# EAGLE schematic TigardBR (EAGLE 9.6.2)
H1: Controlando Elétrons; H2: Tiago Silva; PROJECT: TigardBR
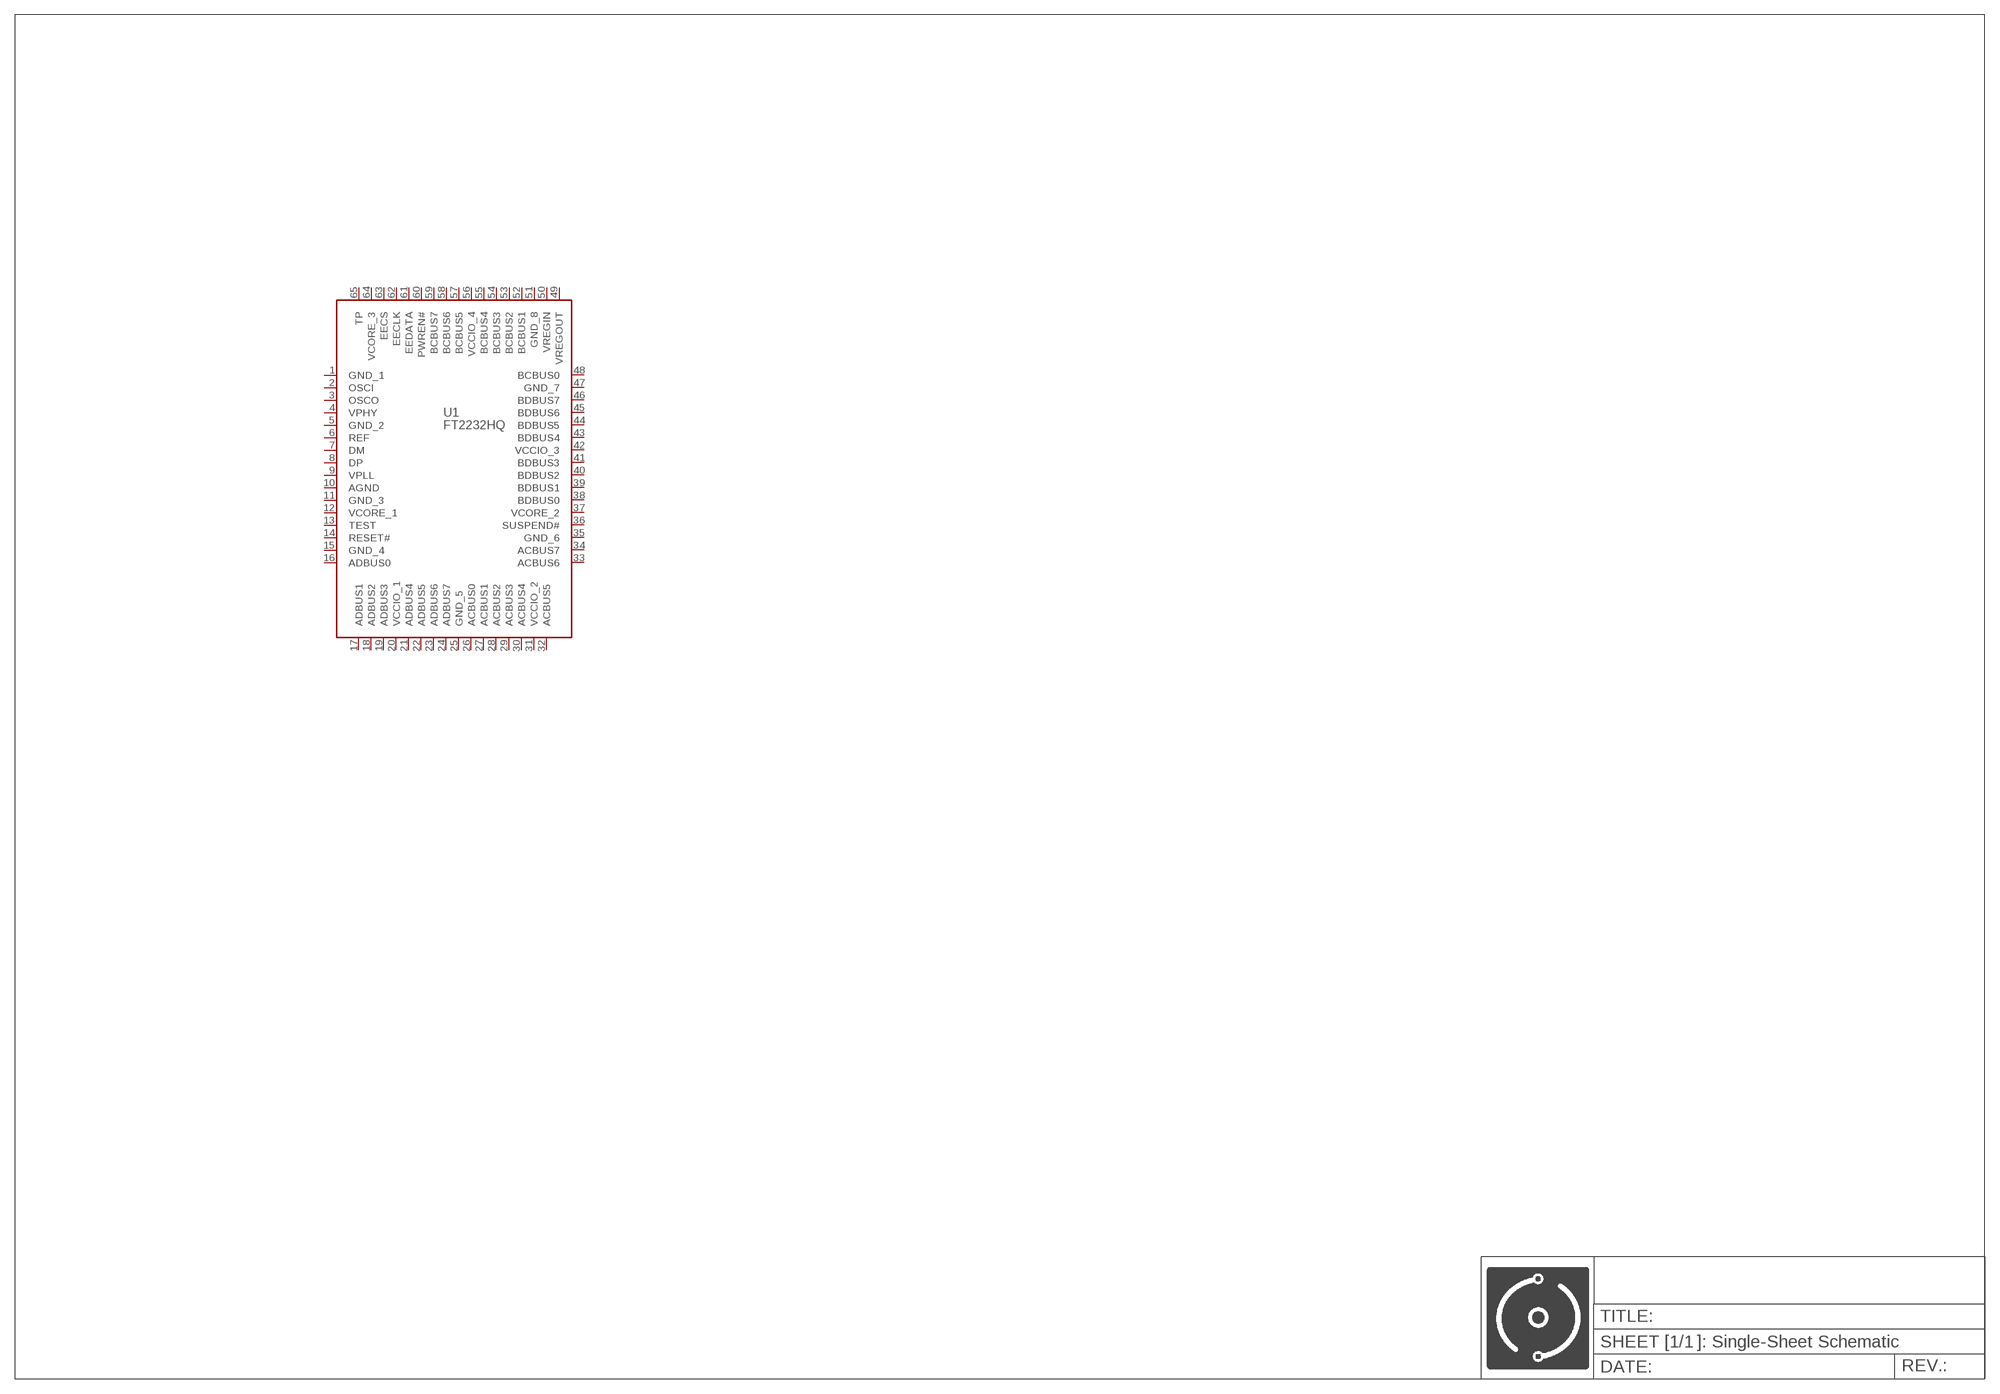
[diagram p0: schematic, sheet 1]

## Parts
U1  FT2232HQ  [QFN-64]
Unconnected: U1.1(GND_1) U1.2(OSCI) U1.3(OSCO) U1.4(VPHY) U1.5(GND_2) U1.6(REF) U1.7(DM) U1.8(DP) U1.9(VPLL) U1.10(AGND) U1.11(GND_3) U1.12(VCORE_1) U1.13(TEST) U1.14(RESET#) U1.15(GND_4) U1.16(ADBUS0) U1.17(ADBUS1) U1.18(ADBUS2) U1.19(ADBUS3) U1.20(VCCIO_1) U1.21(ADBUS4) U1.22(ADBUS5) U1.23(ADBUS6) U1.24(ADBUS7) U1.25(GND_5) U1.26(ACBUS0) U1.27(ACBUS1) U1.28(ACBUS2) U1.29(ACBUS3) U1.30(ACBUS4) U1.31(VCCIO_2) U1.32(ACBUS5) U1.33(ACBUS6) U1.34(ACBUS7) U1.35(GND_6) U1.36(SUSPEND#) U1.37(VCORE_2) U1.38(BDBUS0) U1.39(BDBUS1) U1.40(BDBUS2) U1.41(BDBUS3) U1.42(VCCIO_3) U1.43(BDBUS4) U1.44(BDBUS5) U1.45(BDBUS6) U1.46(BDBUS7) U1.47(GND_7) U1.48(BCBUS0) U1.49(VREGOUT) U1.50(VREGIN) U1.51(GND_8) U1.52(BCBUS1) U1.53(BCBUS2) U1.54(BCBUS3) U1.55(BCBUS4) U1.56(VCCIO_4) U1.57(BCBUS5) U1.58(BCBUS6) U1.59(BCBUS7) U1.60(PWREN#) U1.61(EEDATA) U1.62(EECLK) U1.63(EECS) U1.64(VCORE_3) U1.65(TP)

## Library data of the parts
U1 = My-ICs:FT2232HQ: FT2232H Dual High Speed USB to Multipurpose UART/FIFO IC; PN: FT2232HQ